# Altium schematic sheet CAN Bus Network.SchDoc
size B; SheetNumber: 4; SheetTotal: 4
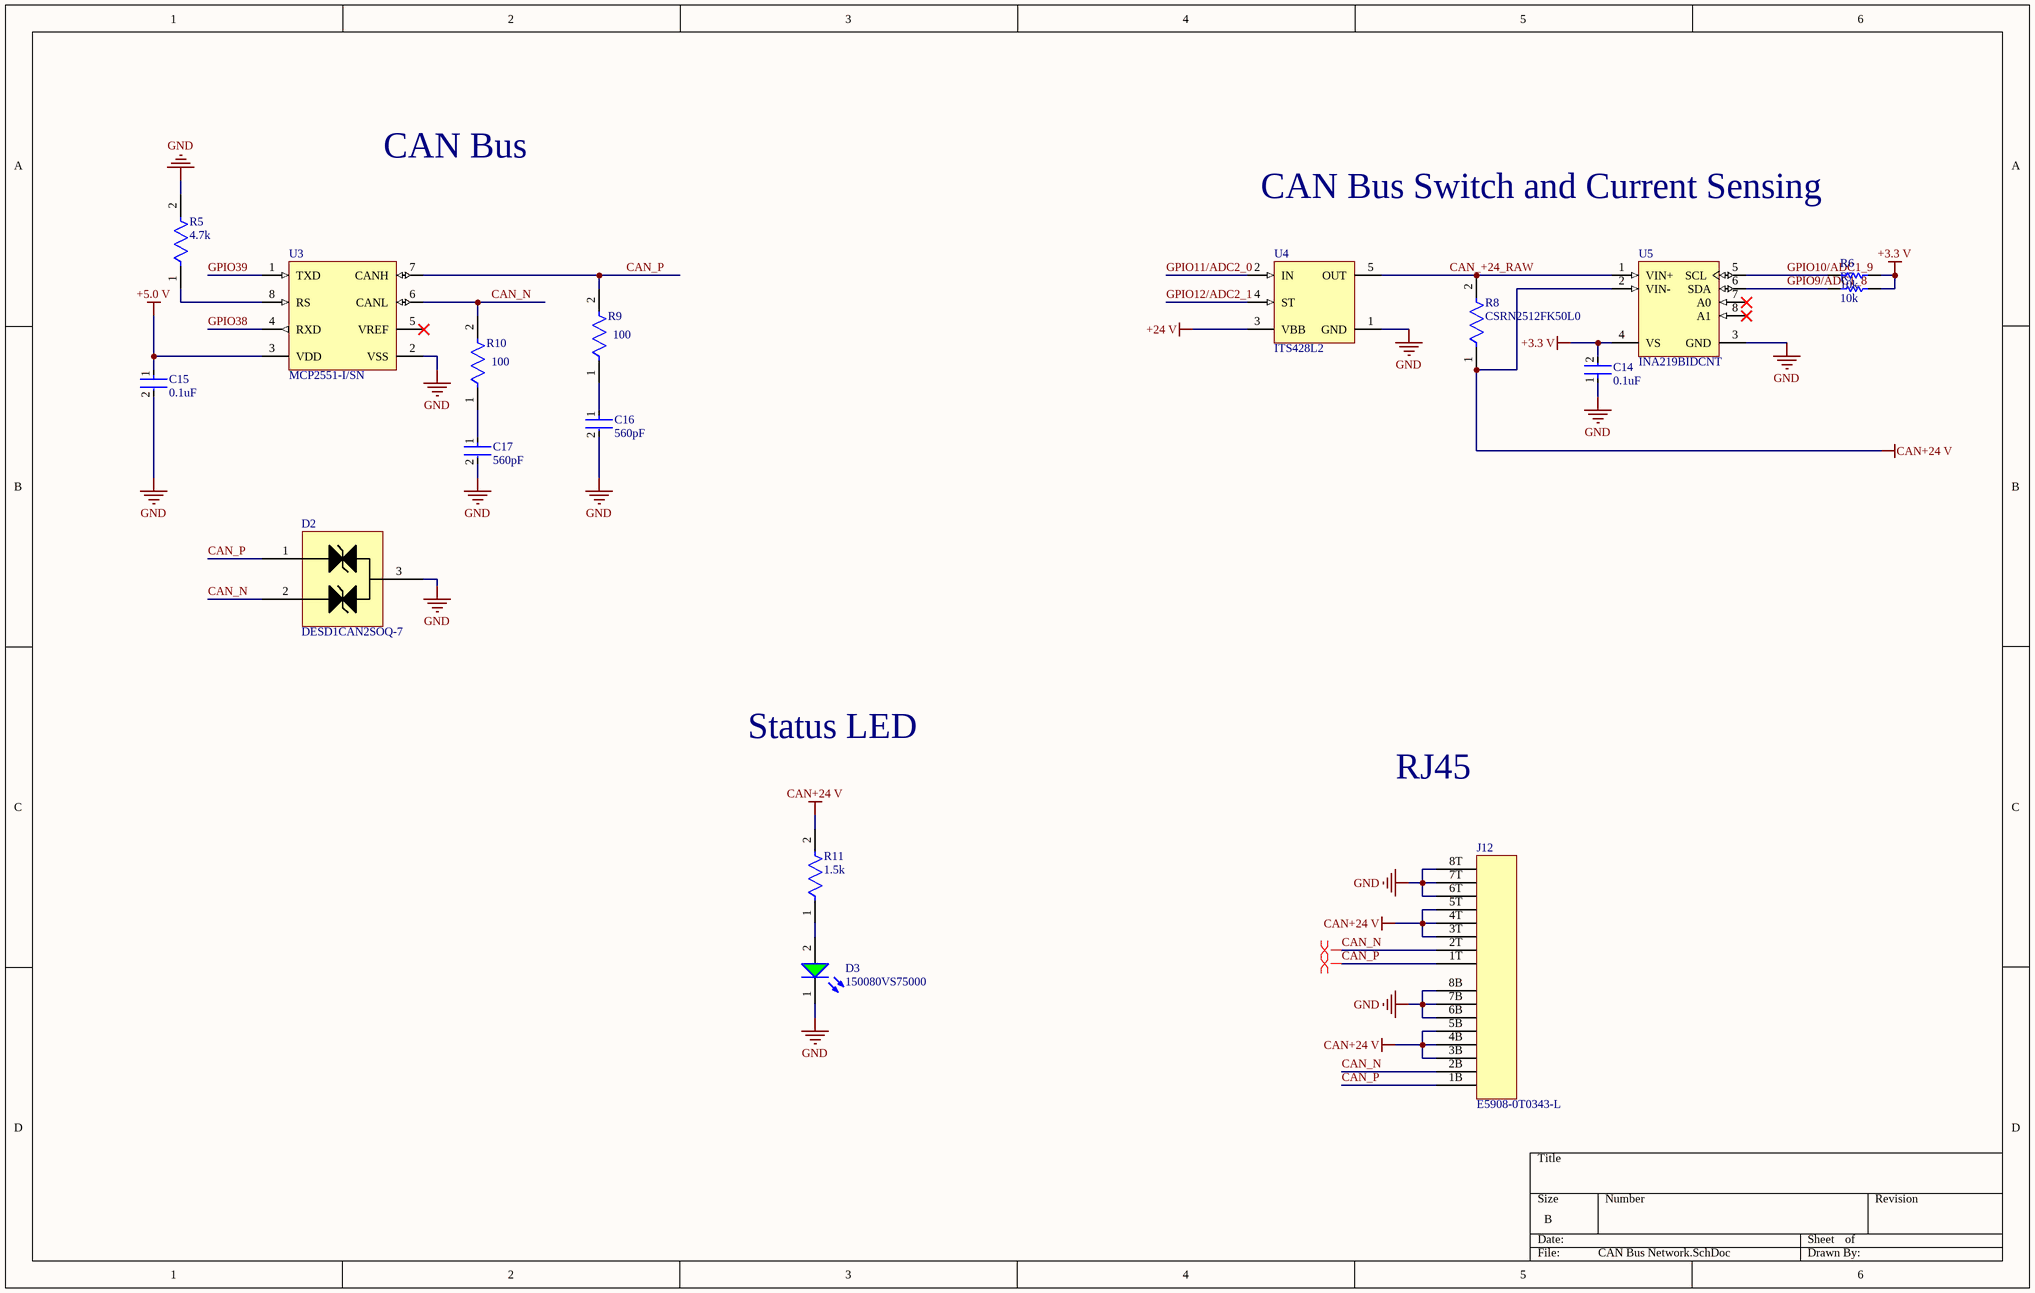
[diagram p0: CAN Bus Network.SchDoc]

## Parts
C14  0.1uF  [FP-CC0603-DA-IPC_A]
C15  0.1uF  [FP-CC0603-DA-IPC_A]
C16  560pF  [FP-CC1206-1_25-IPC_A]
C17  560pF  [FP-CC1206-1_25-IPC_A]
D2  DESD1CAN2SOQ-7  [SOT95P245X110-3N]
D3  150080VS75000  [WL-SMCW_0805_150080xx75000]
J12  E5908-0T0343-L  [E5908-0T0343-L-Footprint-1]
R5  4.7k  [FP-RT0805-IPC_A]
R6  10k  [RESC2013X60X35ML10T20]
R7  10k  [RESC2013X60X35ML10T20]
R8  CSRN2512FK50L0  [FP-CSRN2512-IPC_B]
R9  100  [FP-RT0805-0_6-IPC_A]
R10  100  [FP-RT0805-0_6-IPC_A]
R11  1.5k  [FP-RT0805-IPC_A]
U3  MCP2551-I/SN  [MCHP-SN8_V]
U4  ITS428L2  [INF-PG-TO252-5-11_M]
U5  INA219BIDCNT  [DCN0008A_M]

## Nets
+3.3 V: C14.2 R6.1 R7.1 U5.4(VS)
+5.0 V: C15.1 U3.3(VDD)
+24 V: U4.3(VBB)
CAN+24 V: J12.3B J12.3T J12.4B J12.4T J12.5B J12.5T R8.1 R11.2 U5.2(VIN-)
GND: C14.1 C15.2 C16.2 C17.2 D2.3 D3.1(K) J12.6B J12.6T J12.7B J12.7T J12.8B J12.8T R5.2 U3.2(VSS) U4.1(GND) U5.3(GND)
CAN_+24_RAW: R8.2 U4.5(OUT) U5.1(VIN+)
CAN_N: D2.2 J12.2B J12.2T R10.2 U3.6(CANL)
CAN_P: D2.1 J12.1B J12.1T R9.2 U3.7(CANH)
GPIO9/ADC1_8: R7.2 U5.6(SDA)
GPIO10/ADC1_9: R6.2 U5.5(SCL)
GPIO11/ADC2_0: U4.2(IN)
GPIO12/ADC2_1: U4.4(ST)
GPIO38: U3.4(RXD)
GPIO39: U3.1(TXD)
NetC16_1: C16.1 R9.1
NetC17_1: C17.1 R10.1
NetD3_2: D3.2(A) R11.1
NetR5_1: R5.1 U3.8(RS)

Not connected (* = marked no-connect by the designer): U3 5(VREF)*; U5 7(A0)* 8(A1)*

## Layout directives
differential pair: CAN_N, CAN_P

## Notes on the sheet
- CAN Bus
- CAN Bus Switch and Current Sensing
- Status LED
- RJ45

## Library data of the parts
C14 C15 = CMP-00002-1: Ceramic Capacitor, Multilayer, Ceramic, 50V, 10% +Tol, 10% -Tol, X7R, 15% TC, 0.1uF, Surface Mount, 0603; Value: 100nF; Multilayer: Yes; Reach SVHC Compliant: Yes; Temperature Characteristics Code: X7R; Package Style: SMTMeter; Max Operating Temperature: 125°C; Dielectric Material: Ceramic; Mounting Technology: Surface Mount; Packaging: Tape and Reel; Width: 0.8mm; Min Operating Temperature: -55°C; Height: 0.8mm; RoHS Compliant: Yes; Rated DC Voltage (URdc): 50V; Tolerance (fill in as +-): 10%; Terminal Finish: Nickel; Case/Package: 0603; Length: 1.6mm; Tolerance  (fill in as +-): 10%; JESD-609 Code: e3; Package Shape: Rectangular; Capacitor Type: Ceramic; Pins: 2; Termination: Wraparound
C16 C17 = CMP-00008-1: Ceramic Capacitor, Multilayer, Ceramic, 50V, 10% +Tol, 10% -Tol, X7R, 15% TC, 0.00056uF, Surface Mount, 1206; Multilayer: Yes; Terminal Finish: Tin; Tolerance  (fill in as +-): 10%; Case/Package: 1206; Max Operating Temperature: 125°C; Packaging: Tape and Reel; Min Operating Temperature: -55°C; Mounting Technology: Surface Mount; Rated DC Voltage (URdc): 50V; Pins: 2; Capacitor Type: Ceramic; RoHS Compliant: Yes; Reach SVHC Compliant: Yes; Tolerance (fill in as +-): 10%; Package Shape: Rectangular; Termination: Wraparound; Dielectric Material: Ceramic; Temperature Characteristics Code: X7R; Value: 560pF; JESD-609 Code: e3
D2 = CMP-00024-2: Trans Voltage Suppressor Diode, 200W, 24V V(RWM), Bidirectional, 2 Element, Silicon; Time @ Peak Reflow Temperature-Max (s): 30s; Reference Standard: AEC-Q101; Max Power Dissipation: 300mW; Min Breakdown Voltage: 25.4V; Number of Elements: 2; Additional Feature: HIGH RELIABILITY; Max Breakdown Voltage: 30.3V; Package Body Material: Plastic; Technology: AVALANCHE; JESD-30 Code: R-PDSO-G3; Reach SVHC Compliant: Yes; RoHS Compliant: Yes; Min Operating Temperature: -65°C; JESD-609 Code: e3; Surface Mount: Yes; Max Operating Temperature: 150°C; Pins: 3; Terminal Position: DUAL; Package Shape: Rectangular; Polarity: Bidirectional; Non-rep Peak Rev Power Dis-Max: 200W; Moisture Sensitivity Level: 1; Terminal Finish: Tin; Package Style: SMALL OUTLINEMeter; Peak Reflow Temperature (Cel): 260°C; Rep Pk Reverse Voltage-Max: 24V; Terminal Form: Gull Wing; Diode Type: TRANS VOLTAGE SUPPRESSOR; Diode Element Material: SILICON
D3 = CMP-00021-1: Single Color LED, Bright Green, Water Clear, 1.4mm; Shape: Rectangular; Luminous Intensity-Nom: 40mcd; Viewing Angle: 140°; Channels: 1; Forward Current: 30mA; Overall Height: 0.7mm; RoHS Compliant: Yes; Max Operating Temperature: 85°C; Optoelectronic Device Type: SINGLE COLOR LED; Color: Green; Min Operating Temperature: -40°C; Terminal Pitch: 2.1mm; Mounting Technology: Surface Mount; Packaging: Tape and Reel; Reach SVHC Compliant: Yes; Size: 1.4mm; Lens Style: WATER CLEAR; Pins: 2
J12 = CMP-002-00077-7: Telecom and Datacom Connector, 16 Contact(s), Female, Right Angle, Solder Terminal, Jack; Manufacturer Series: E5908; Mixed Contacts: No; Number of Contacts: 16; Option: General Purpose; RoHS Compliant: Yes; Contact Finish - Mating: GOLD (15) OVER NICKEL; Shell Material: Glass; Body/Shell Style: JACK; Mounting Technology: Board; Contact Gender: Female; Termination: Solder; JESD-609 Code: e4; Filter Feature: No; Mounting Style: RIGHT ANGLE; IEC Conformance: No; Reach SVHC Compliant: Yes; Flammability Rating: UL94 V-0; DIN Conformance: No; Contact Finish - Termination: GOLD (15) OVER NICKEL; Insulation Material: Glass; Empty Shell: No; MIL Conformance: No; Connector Type: TELECOM AND DATACOM CONNECTOR
R5 = CMP-00015-1: Fixed Resistor, Thin Film, 0.125W, 4700ohm, 150V, 1% +/-Tol, 50ppm/Cel, Surface Mount, 0805; Temperature Coefficient: 50ppm/°C; Package Height: 0.5mm; Rated Temperature: 70°C; Power: 125mW; Additional Feature: HIGH PRECISION; Value: 4.7kR; Package Length: 2mm; Package Width: 1.25mm; Construction: Chip; Resistor Type: FIXED RESISTOR; Pins: 2; Reach SVHC Compliant: Yes; Tolerance: 1%; Package Style: SMTMeter; Packaging: Tape and Reel; RoHS Compliant: Yes; Termination: Wraparound; Mounting Technology: Surface Mount; Case/Package: 0805; Max Operating Temperature: 155°C; Technology: THIN FILM; Min Operating Temperature: -55°C; Working Voltage: 150V
R6 R7 = CMP-00012-1: Fixed Resistor, Metal Glaze/thick Film, 0.125W, 10000ohm, 150V, 1% +/-Tol, 100ppm/Cel, Surface Mount, 0805; Package Width: 1.25mm; Rated Temperature: 70°C; Package Height: 0.5mm; Power: 125mW; Additional Feature: LASER TRIMMABLE; Temperature Coefficient: 100ppm/°C; Value: 10kR; Package Length: 2mm; Min Operating Temperature: -55°C; Working Voltage: 150V; Case/Package: 0805; Construction: Chip; Termination: Wraparound; Package Shape: Rectangular; Packaging: Tape and Reel; Technology: METAL GLAZE/THICK FILM; RoHS Compliant: Yes; Tolerance: 1%; Reach SVHC Compliant: Yes; Mounting Technology: Surface Mount; Pins: 2; Terminal Finish: Nickel; JESD-609 Code: e3; Max Operating Temperature: 155°C; Package Style: SMTMeter; Resistor Type: FIXED RESISTOR
R8 = CMP-00034-1: Fixed Resistor, Metal Glaze/thick Film, 2W, 0.05ohm, 1% +/-Tol, 200ppm/Cel, Surface Mount, 2512; Temperature Coefficient: 200ppm/°C; Rated Temperature: 70°C; Package Height: 0.6mm; Package Width: 3.15mm; Value: 50mR; Package Length: 6.35mm; Package Style: SMTMeter; Terminal Finish: Nickel; RoHS Compliant: Yes; Power: 2W; Pins: 2; Package Shape: Rectangular; Construction: Rectangular; Resistor Type: FIXED RESISTOR; Case/Package: 2512; Max Operating Temperature: 155°C; Tolerance: 1%; JESD-609 Code: e3; Technology: METAL GLAZE/THICK FILM; Packaging: Tape and Reel; Mounting Technology: Surface Mount; Reach SVHC Compliant: Yes; Min Operating Temperature: -55°C; Termination: Wraparound
R9 R10 = CMP-00016-1: Fixed Resistor, Thin Film, 0.125W, 100ohm, 150V, 0.1% +/-Tol, 25ppm/Cel, Surface Mount, 0805; Package Height: 0.5mm; Package Length: 2mm; Rated Temperature: 70°C; Temperature Coefficient: 25ppm/°C; Value: 100R; Power: 125mW; Additional Feature: HIGH PRECISION; Package Width: 1.25mm; Packaging: Tape and Reel; Max Operating Temperature: 155°C; Construction: Chip; Pins: 2; Termination: Wraparound; Mounting Technology: Surface Mount; Reach SVHC Compliant: Yes; Case/Package: 0805; Package Style: SMTMeter; RoHS Compliant: Yes; Working Voltage: 150V; Min Operating Temperature: -55°C; Technology: THIN FILM; Resistor Type: FIXED RESISTOR; Tolerance: 0.1%
R11 = CMP-00013-1: Fixed Resistor, Thin Film, 0.125W, 1500ohm, 150V, 1% +/-Tol, 50ppm/Cel, Surface Mount, 0805; Package Width: 1.25mm; Package Height: 0.5mm; Additional Feature: HIGH PRECISION; Temperature Coefficient: 50ppm/°C; Power: 125mW; Rated Temperature: 70°C; Package Length: 2mm; Value: 1.5kR; Termination: Wraparound; Packaging: Tape and Reel; Reach SVHC Compliant: Yes; Pins: 2; Working Voltage: 150V; Construction: Chip; Package Style: SMTMeter; Max Operating Temperature: 155°C; Case/Package: 0805; Resistor Type: FIXED RESISTOR; Mounting Technology: Surface Mount; Technology: THIN FILM; Min Operating Temperature: -55°C; Tolerance: 1%; RoHS Compliant: Yes
U3 = CMP-015-00008-2: CAN Transceiver, 1-Trnsvr, PDSO8; Max Supply Current: 75uA; Power Supplies: 5V; Number of Transceivers: 1; Data Rate: 1000Mbps; Qualification Status: Not Qualified; Time @ Peak Reflow Temperature-Max (s): 40s; Telecom IC Type: INTERFACE CIRCUIT; Package Equivalence Code: SOP8,.25; Package Body Material: Plastic; Technology: CMOS; Min Operating Temperature: -40°C; RoHS Compliant: Yes; Height - Seated (Max): 1.75mm; Terminal Position: DUAL; Surface Mount: Yes; Package Style: SMALL OUTLINEMeter; Terminal Finish: Tin; Terminal Pitch: 1.27mm; JESD-30 Code: R-PDSO-G8; Case/Package: SOP; Nominal Supply Voltage: 5V; Width: 3.9mm; Length: 4.9mm; Peak Reflow Temperature (Cel): 260°C; Package Shape: Rectangular; Channels: 1; Reach SVHC Compliant: Yes; Pins: 8; Temperature Grade: INDUSTRIAL; Terminal Form: Gull Wing; JESD-609 Code: e3; Max Operating Temperature: 85°C; Moisture Sensitivity Level: 1
U4 = CMP-00032-2: Buffer/Inverter Based Peripheral Driver, 1 Driver, 1.8A, PSSO4; Power Supplies: 12V; Driver Number of Bits: 1; Qualification Status: Not Qualified; Max Supply Voltage: 43V; Interface IC Type: BUFFER OR INVERTER BASED PERIPHERAL DRIVER; Turn-Off Delay Time: 200us; Built-in Protections: Over Current,Over Voltage,Under Voltage,TRANSIENT,THERMAL; Nominal Supply Voltage: 5V; Min Supply Voltage: 4.75V; Output Current Flow Direction: SINK; Package Body Material: Plastic; Package Shape: Rectangular; RoHS Compliant: Yes; Moisture Sensitivity Level: 1; Terminal Pitch: 1.14mm; Case/Package: TO-252; Width: 6.22mm; Height - Seated (Max): 2.5mm; Terminal Form: Gull Wing; Min Operating Temperature: -30°C; Terminal Position: SINGLE; Pins: 4; Max Operating Temperature: 85°C; Package Style: SMALL OUTLINEMeter; Channels: 1; Turn-On Delay Time: 200us; Reach SVHC Compliant: No; Surface Mount: Yes; Output Peak Current Limit-Nom: 1.8A; Temperature Grade: COMMERCIAL EXTENDED; Length: 6.5mm
U5 = CMP-00029-1: Power Supply Support Circuit, Fixed, 2 Channel, 2V, PDSO8; Package Equivalence Code: TSSOP8,.1; Power Supplies: 3.3V; Number of Channels: 2; Package Body Material: Plastic; Supply Current-Max (Isup): 1mA; Qualification Status: Not Qualified; Channels: 1; Min Supply Voltage: 3V; Adjustable Threshold: No; Max Supply Voltage: 5.5V; Length: 2.9mm; Temperature Grade: AUTOMOTIVE; Terminal Position: DUAL; Surface Mount: Yes; Terminal Form: Gull Wing; Terminal Pitch: 0.65mm; Case/Package: LSSOP; Moisture Sensitivity Level: 2; JESD-30 Code: R-PDSO-G8; Width: 1.6mm; Min Operating Temperature: -40°C; Throw Configuration: POWER SUPPLY SUPPORT CIRCUIT; Package Shape: Rectangular; Height - Seated (Max): 1.45mm; Terminal Finish: Nickel; JESD-609 Code: e4; Peak Reflow Temperature (Cel): 260°C; Nominal Supply Voltage: 3.3V; Package Style: SMALL OUTLINE, LOW PROFILE, SHRINK PITCHMeter; Pins: 8; RoHS Compliant: Yes; Max Operating Temperature: 125°C; Reach SVHC Compliant: Yes